# Altium schematic sheet Sheet1.SchDoc
size OrCAD D; SheetNumber: 1; SheetTotal: 1
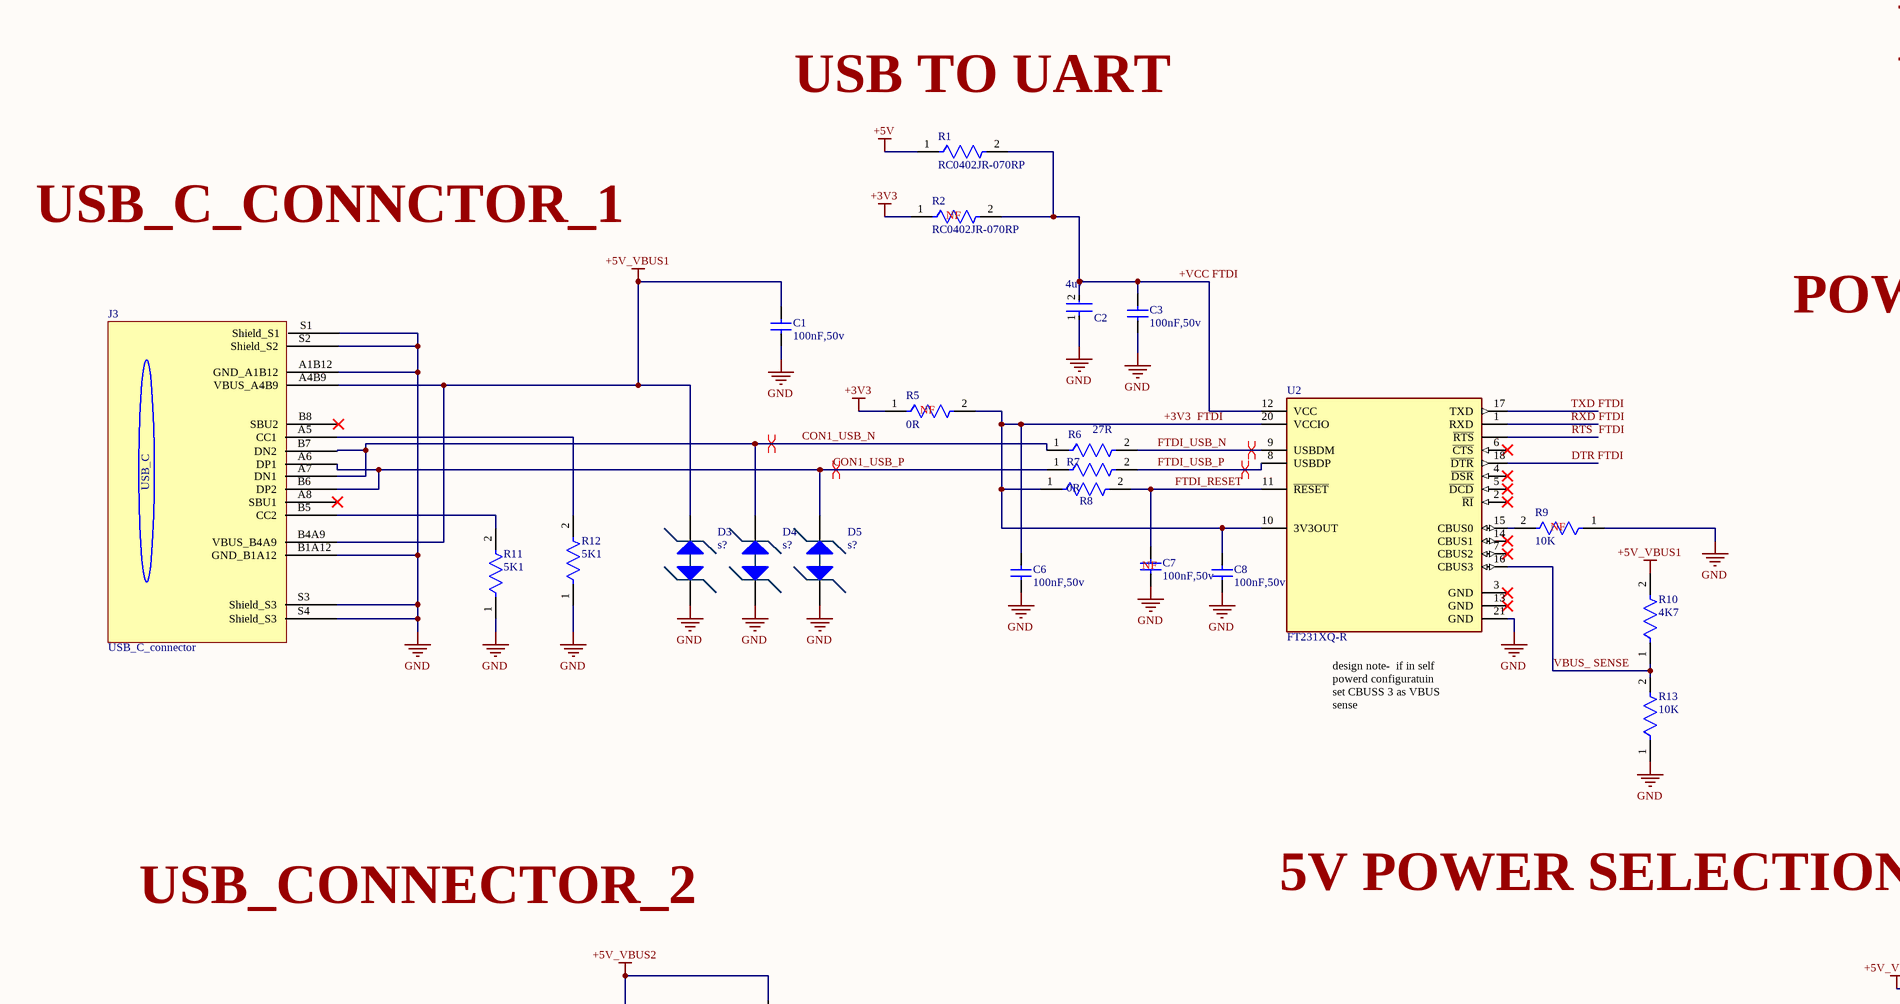
[diagram p0: Sheet1.SchDoc, top left]
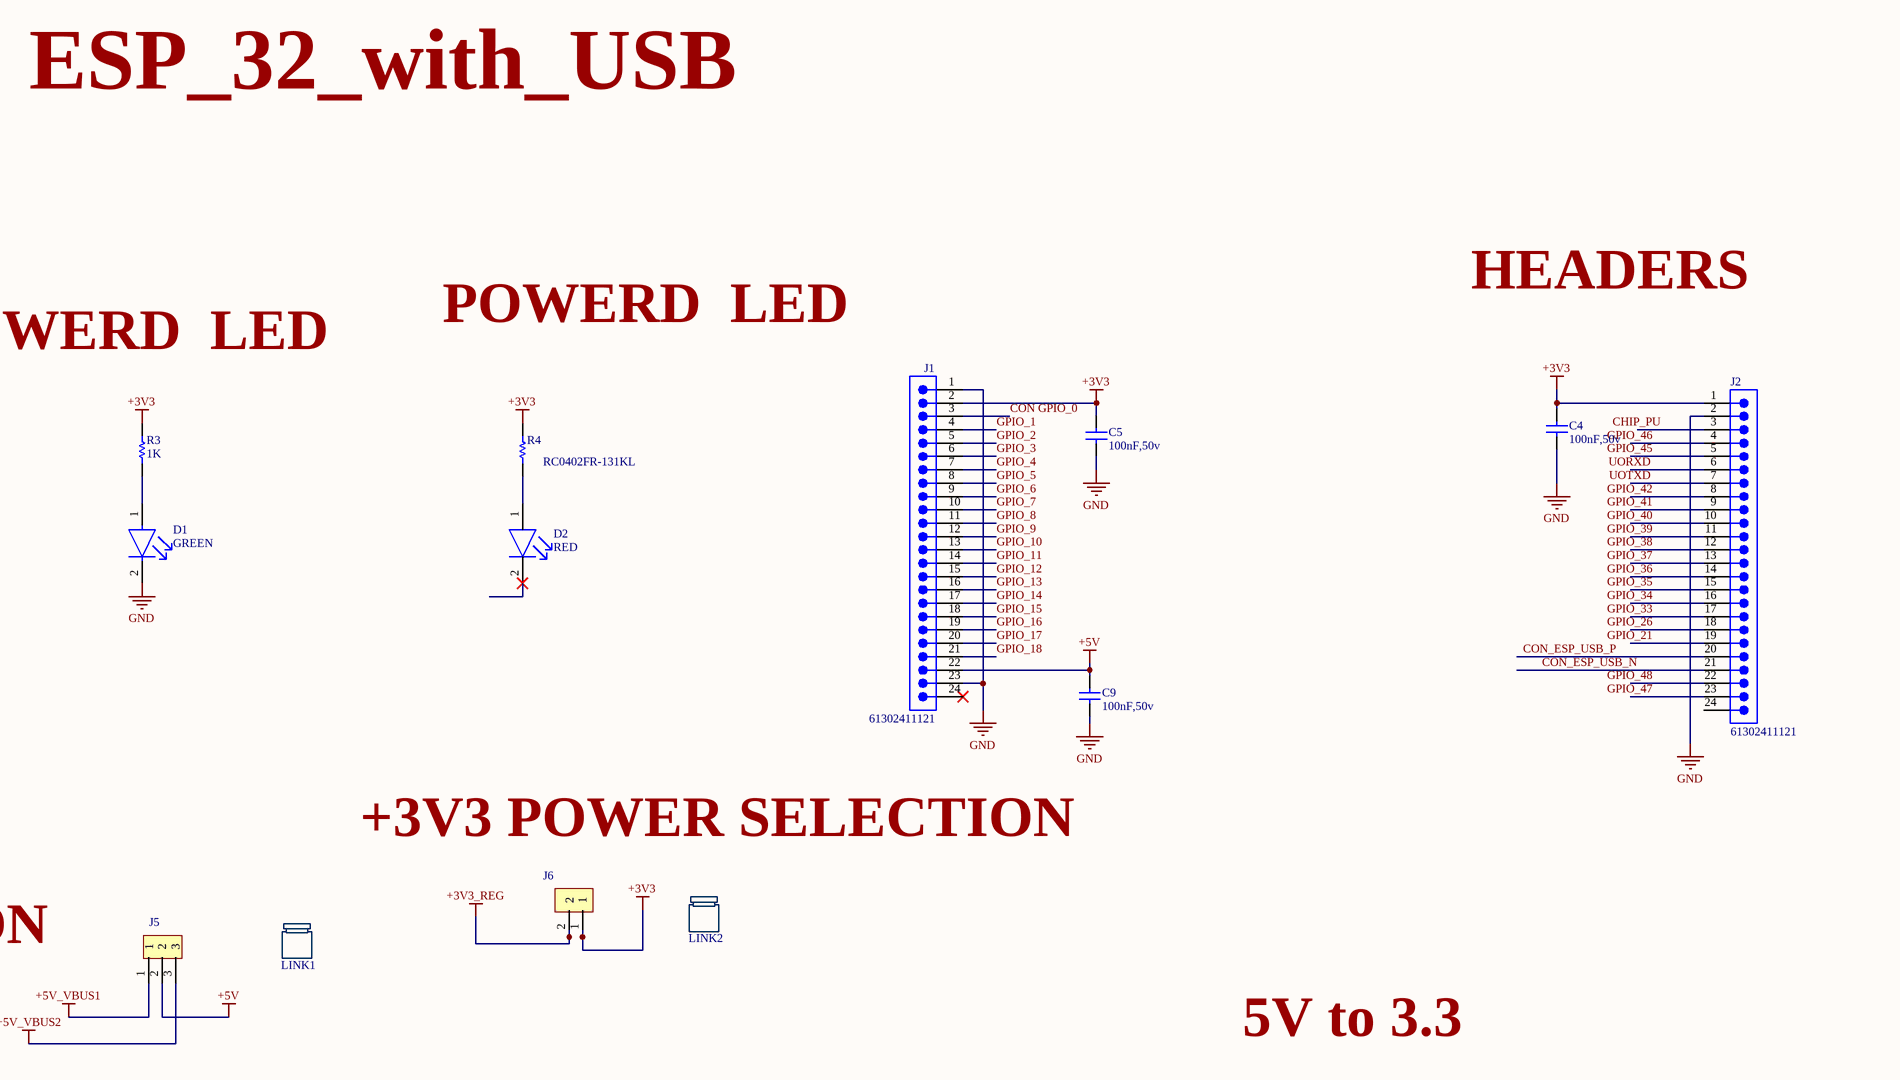
[diagram p1: Sheet1.SchDoc, top right]
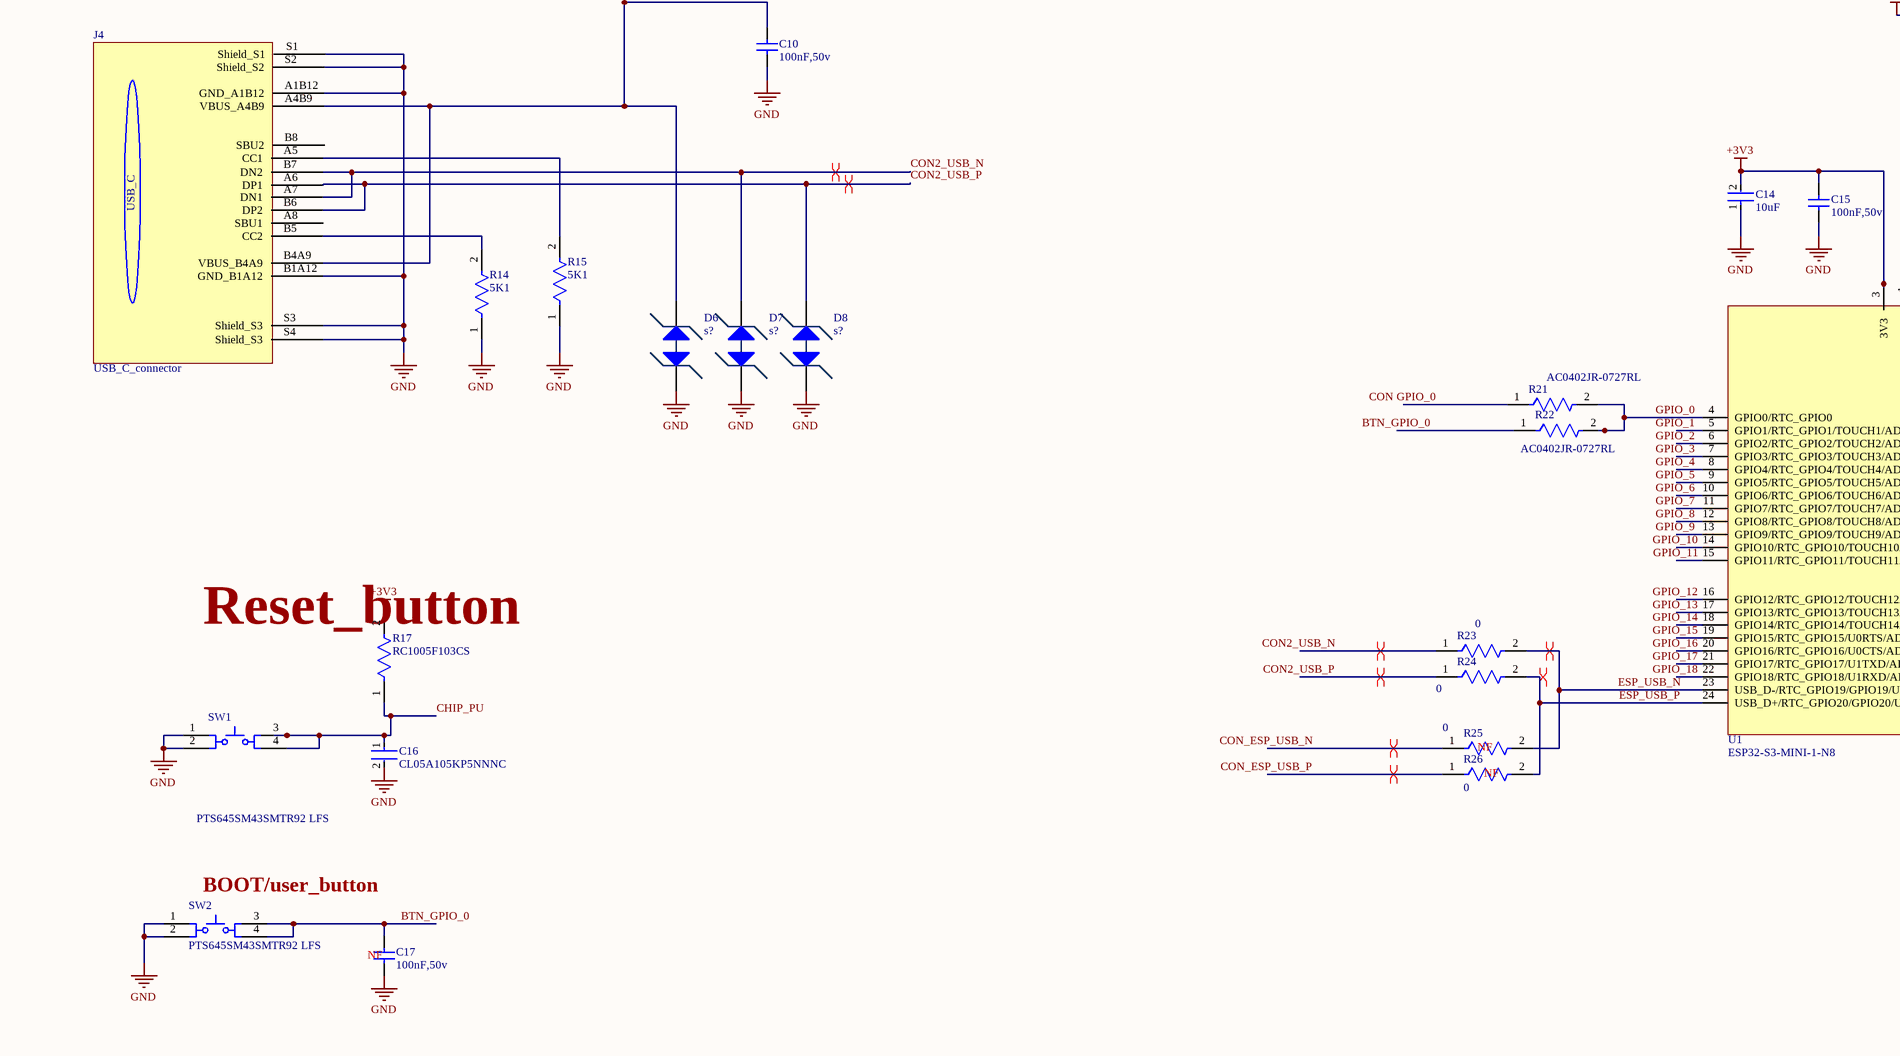
[diagram p2: Sheet1.SchDoc, bottom left]
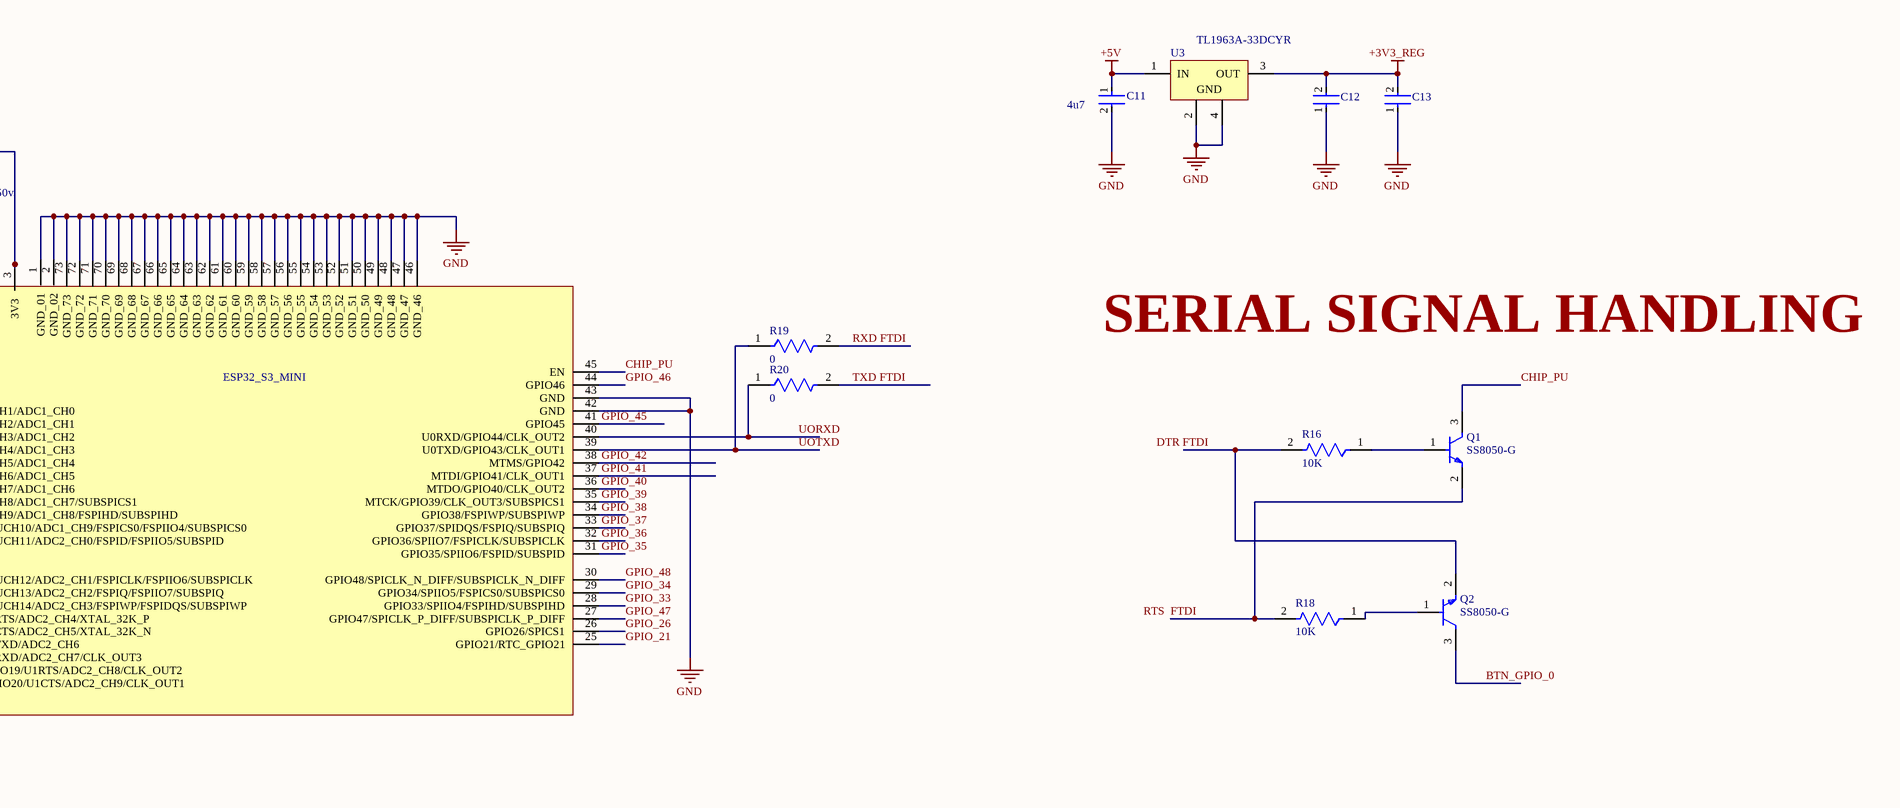
[diagram p3: Sheet1.SchDoc, bottom right]

## Parts
C1  100nF,50v  [CAPC1005X55N]
C2  4u7  [FP-CL829-IPC_C]
C3  100nF,50v  [CAPC1005X55N]
C4  100nF,50v  [CAPC1005X55N]
C5  100nF,50v  [CAPC1005X55N]
C6  100nF,50v  [CAPC1005X55N]
C7  100nF,50v  [CAPC1005X55N]
C8  100nF,50v  [CAPC1005X55N]
C9  100nF,50v  [CAPC1005X55N]
C10  100nF,50v  [CAPC1005X55N]
C11  4u7  [FP-CL829-IPC_C]
C12  CL05A106MP8NUB8  [FP-CL07-IPC_C]  (value not drawn)
C13  CL05A106MP8NUB8  [FP-CL07-IPC_C]  (value not drawn)
C14  10uF  [FP-CL07-IPC_C]
C15  100nF,50v  [CAPC1005X55N]
C16  CL05A105KP5NNNC  [FP-CL511-IPC_C]
C17  100nF,50v  [CAPC1005X55N]
D1  GREEN  [FP-SM0402GC-MFG]
D2  RED  [FP-SM0402RC-MFG]
D3  s?  [SOD882]
D4  s?  [SOD882]
D5  s?  [SOD882]
D6  s?  [SOD882]
D7  s?  [SOD882]
D8  s?  [SOD882]
J1  61302411121  [61302411121]
J2  61302411121  [61302411121]
J3  USB_C_connector  [FP-2171790001-MFG]
J4  USB_C_connector  [FP-2171790001-MFG]
J5  FTS-103-01-F-S  [HDR_1X3_1.27MM]  (value not drawn)
J6  FTS-102-01-F-S  [HDR_1X2_1.27MM]  (value not drawn)
LINK1  M50-1920005  (value not drawn)  (mechanical)
LINK2  M50-1920005  (value not drawn)  (mechanical)
Q1  SS8050-G  [FP-SS8050-G-MFG]
Q2  SS8050-G  [FP-SS8050-G-MFG]
R1  RC0402JR-070RP  [FP-RC0402-0_4-MFG]
R2  RC0402JR-070RP  [FP-RC0402-0_4-MFG]
R3  1K  [RESC1005X40X25LL05T10]
R4  RC0402FR-131KL  [RESC1005X40X25LL05T10]
R5  0R  [FP-RC0402-0_4-MFG]
R6  27R  [FP-AC0402-MFG]
R7  27R  [FP-AC0402-MFG]  (value not drawn)
R8  0R  [FP-RC0402-0_4-MFG]
R9  10K  [FP-CRGCQ0402-IPC_C]
R10  4K7  [FP-CRGP0402-IPC_C]
R11  5K1  [FP-RC1005-MFG]
R12  5K1  [FP-RC1005-MFG]
R13  10K  [FP-CRGCQ0402-IPC_C]
R14  5K1  [FP-RC1005-MFG]
R15  5K1  [FP-RC1005-MFG]
R16  10K  [FP-CRGCQ0402-IPC_C]
R17  RC1005F103CS  [FP-RC1005-IPC_B]
R18  10K  [FP-CRGCQ0402-IPC_C]
R19  0  [FP-RC0402-0_4-MFG]
R20  0  [FP-RC0402-0_4-MFG]
R21  AC0402JR-0727RL  [FP-AC0402-MFG]
R22  AC0402JR-0727RL  [FP-AC0402-MFG]
R23  0  [FP-RC0402-0_4-MFG]
R24  0  [FP-RC0402-0_4-MFG]
R25  0  [FP-RC0402-0_4-MFG]
R26  0  [FP-RC0402-0_4-MFG]
SW1  PTS645SM43SMTR92 LFS  [CKCP-PTS645S_V]
SW2  PTS645SM43SMTR92 LFS  [CKCP-PTS645S_V]
U1  ESP32-S3-MINI-1-N8  [XCVR_ESP32-S3-MINI-1-N8]
U2  FT231XQ-R  [FP-QFN-20-MFG]
U3  TL1963A-33DCYR  [DCY0004A_N]

## Nets
+3V3: C4.2 C5.2 C14.2 C15.2 J1.2 J2.1 J6.1 R2.1 R3.2 R4.2 R5.1 R17.2 U1.3(3V3)
+3V3_REG: C12.2 C13.2 J6.2 U3.3(OUT)
+5V: C9.2 C11.1 J1.22 J5.2 R1.1 U3.1(IN)
+5V_VBUS1: C1.2 D3.2 J3.A4B9(VBUS_A4B9) J3.B4A9(VBUS_B4A9) J5.1 R10.2
+5V_VBUS2: C10.2 D6.2 J4.A4B9(VBUS_A4B9) J4.B4A9(VBUS_B4A9) J5.3
GND: C1.1 C2.1 C3.1 C4.1 C5.1 C6.1 C7.1 C8.1 C9.1 C10.1 C11.2 C12.1 C13.1 C14.1 C15.1 C16.2 C17.1 D1.2(C) D3.1 D4.1 D5.1 D6.1 D7.1 D8.1 J1.1 J1.23 J2.2 J3.A1B12(GND_A1B12) J3.B1A12(GND_B1A12) J3.S1(Shield_S1) J3.S2(Shield_S2) J3.S3(Shield_S3) J3.S4(Shield_S3) J4.A1B12(GND_A1B12) J4.B1A12(GND_B1A12) J4.S1(Shield_S1) J4.S2(Shield_S2) J4.S3(Shield_S3) J4.S4(Shield_S3) R9.1 R11.1 R12.1 R13.1 R14.1 R15.1 SW1.1 SW1.2 SW2.1 SW2.2 U1.1(GND_01) U1.2(GND_02) U1.42(GND) U1.43(GND) U1.46(GND_46) U1.47(GND_47) U1.48(GND_48) U1.49(GND_49) U1.50(GND_50) U1.51(GND_51) U1.52(GND_52) U1.53(GND_53) U1.54(GND_54) U1.55(GND_55) U1.56(GND_56) U1.57(GND_57) U1.58(GND_58) U1.59(GND_59) U1.60(GND_60) U1.61(GND_61) U1.62(GND_62) U1.63(GND_63) U1.64(GND_64) U1.65(GND_65) U1.66(GND_66) U1.67(GND_67) U1.68(GND_68) U1.69(GND_69) U1.70(GND_70) U1.71(GND_71) U1.72(GND_72) U1.73(GND_73) U2.21(GND) U3.2(GND) U3.4(GND)
+3V3  FTDI: C6.2 C8.2 R5.2 R8.1 U2.10(3V3OUT) U2.20(VCCIO)
+VCC FTDI: C2.2 C3.2 R1.2 R2.2 U2.12(VCC)
BTN_GPIO_0: C17.2 Q2.3(C) R22.1 SW2.3 SW2.4
CHIP_PU: C16.1 J2.3 Q1.3(C) R17.1 SW1.3 SW1.4 U1.45(EN)
CON1_USB_N: D4.2 J3.A7(DN1) J3.B7(DN2) R6.1
CON1_USB_P: D5.2 J3.A6(DP1) J3.B6(DP2) R7.1
CON2_USB_N: D7.2 J4.A7(DN1) J4.B7(DN2) R23.1
CON2_USB_P: D8.2 J4.A6(DP1) J4.B6(DP2) R24.1
CON GPIO_0: J1.3 R21.1
CON_ESP_USB_N: J2.21 R25.1
CON_ESP_USB_P: J2.20 R26.1
DTR FTDI: Q2.2(E) R16.2 U2.18(~{DTR})
ESP_USB_N: R23.2 R25.2 U1.23(USB_D-/RTC_GPIO19/GPIO19/U1RTS/ADC2_CH8/CLK_OUT2)
ESP_USB_P: R24.2 R26.2 U1.24(USB_D+/RTC_GPIO20/GPIO20/U1CTS/ADC2_CH9/CLK_OUT1)
FTDI_RESET: C7.2 R8.2 U2.11(~{RESET})
FTDI_USB_N: R6.2 U2.9(USBDM)
FTDI_USB_P: R7.2 U2.8(USBDP)
GPIO_0: R21.2 R22.2 U1.4(GPIO0/RTC_GPIO0)
GPIO_1: J1.4 U1.5(GPIO1/RTC_GPIO1/TOUCH1/ADC1_CH0)
GPIO_2: J1.5 U1.6(GPIO2/RTC_GPIO2/TOUCH2/ADC1_CH1)
GPIO_3: J1.6 U1.7(GPIO3/RTC_GPIO3/TOUCH3/ADC1_CH2)
GPIO_4: J1.7 U1.8(GPIO4/RTC_GPIO4/TOUCH4/ADC1_CH3)
GPIO_5: J1.8 U1.9(GPIO5/RTC_GPIO5/TOUCH5/ADC1_CH4)
GPIO_6: J1.9 U1.10(GPIO6/RTC_GPIO6/TOUCH6/ADC1_CH5)
GPIO_7: J1.10 U1.11(GPIO7/RTC_GPIO7/TOUCH7/ADC1_CH6)
GPIO_8: J1.11 U1.12(GPIO8/RTC_GPIO8/TOUCH8/ADC1_CH7/SUBSPICS1)
GPIO_9: J1.12 U1.13(GPIO9/RTC_GPIO9/TOUCH9/ADC1_CH8/FSPIHD/SUBSPIHD)
GPIO_10: J1.13 U1.14(GPIO10/RTC_GPIO10/TOUCH10/ADC1_CH9/FSPICS0/FSPIIO4/SUBSPICS0)
GPIO_11: J1.14 U1.15(GPIO11/RTC_GPIO11/TOUCH11/ADC2_CH0/FSPID/FSPIIO5/SUBSPID)
GPIO_12: J1.15 U1.16(GPIO12/RTC_GPIO12/TOUCH12/ADC2_CH1/FSPICLK/FSPIIO6/SUBSPICLK)
GPIO_13: J1.16 U1.17(GPIO13/RTC_GPIO13/TOUCH13/ADC2_CH2/FSPIQ/FSPIIO7/SUBSPIQ)
GPIO_14: J1.17 U1.18(GPIO14/RTC_GPIO14/TOUCH14/ADC2_CH3/FSPIWP/FSPIDQS/SUBSPIWP)
GPIO_15: J1.18 U1.19(GPIO15/RTC_GPIO15/U0RTS/ADC2_CH4/XTAL_32K_P)
GPIO_16: J1.19 U1.20(GPIO16/RTC_GPIO16/U0CTS/ADC2_CH5/XTAL_32K_N)
GPIO_17: J1.20 U1.21(GPIO17/RTC_GPIO17/U1TXD/ADC2_CH6)
GPIO_18: J1.21 U1.22(GPIO18/RTC_GPIO18/U1RXD/ADC2_CH7/CLK_OUT3)
GPIO_21: J2.19 U1.25(GPIO21/RTC_GPIO21)
GPIO_26: J2.18 U1.26(GPIO26/SPICS1)
GPIO_33: J2.17 U1.28(GPIO33/SPIIO4/FSPIHD/SUBSPIHD)
GPIO_34: J2.16 U1.29(GPIO34/SPIIO5/FSPICS0/SUBSPICS0)
GPIO_35: J2.15 U1.31(GPIO35/SPIIO6/FSPID/SUBSPID)
GPIO_36: J2.14 U1.32(GPIO36/SPIIO7/FSPICLK/SUBSPICLK)
GPIO_37: J2.13 U1.33(GPIO37/SPIDQS/FSPIQ/SUBSPIQ)
GPIO_38: J2.12 U1.34(GPIO38/FSPIWP/SUBSPIWP)
GPIO_39: J2.11 U1.35(MTCK/GPIO39/CLK_OUT3/SUBSPICS1)
GPIO_40: J2.10 U1.36(MTDO/GPIO40/CLK_OUT2)
GPIO_41: J2.9 U1.37(MTDI/GPIO41/CLK_OUT1)
GPIO_42: J2.8 U1.38(MTMS/GPIO42)
GPIO_45: J2.5 U1.41(GPIO45)
GPIO_46: J2.4 U1.44(GPIO46)
GPIO_47: J2.23 U1.27(GPIO47/SPICLK_P_DIFF/SUBSPICLK_P_DIFF)
GPIO_48: J2.22 U1.30(GPIO48/SPICLK_N_DIFF/SUBSPICLK_N_DIFF)
RTS  FTDI: Q1.2(E) R18.2 U2.19(~{RTS})
RXD FTDI: R19.2 U2.1(RXD)
TXD FTDI: R20.2 U2.17(TXD)
UORXD: J2.6 R20.1 U1.40(U0RXD/GPIO44/CLK_OUT2)
UOTXD: J2.7 R19.1 U1.39(U0TXD/GPIO43/CLK_OUT1)
VBUS_ SENSE: R10.1 R13.2 U2.16(CBUS3)
NetD1_1: D1.1(A) R3.1
NetD2_1: D2.1(A) R4.1
NetJ3_A5: J3.A5(CC1) R12.2
NetJ3_B5: J3.B5(CC2) R11.2
NetJ4_A5: J4.A5(CC1) R15.2
NetJ4_B5: J4.B5(CC2) R14.2
NetQ1_1: Q1.1(B) R16.1
NetQ2_1: Q2.1(B) R18.1
NetR9_2: R9.2 U2.15(CBUS0)

Not connected (* = marked no-connect by the designer): D2 2(C)*; J1 24*; J2 24; J3 A8(SBU1)* B8(SBU2)*; J4 A8(SBU1) B8(SBU2); U2 2(~{RI})* 3(GND)* 4(~{DSR})* 5(~{DCD})* 6(~{CTS})* 7(CBUS2)* 13(GND)* 14(CBUS1)*

## Layout directives
differential pair; differential pair class *: CON2_USB_N
differential pair: CON1_USB_N, CON1_USB_P, CON2_USB_N, CON2_USB_P, CON_ESP_USB_N, CON_ESP_USB_P, ESP_USB_N, ESP_USB_P, FTDI_USB_N, FTDI_USB_P

## Notes on the sheet
- (near R1) USB TO UART
- ESP_32_with_USB
- USB_C_CONNCTOR_1
- (near R2) NF
- HEADERS
- POWERD  LED
- (near R5) NF
- (near C7) NF
- (near R9) NF
- (near U2) design note-  if in self powerd configuratuin set CBUSS 3 as VBUS sense
- +3V3 POWER SELECTION
- USB_CONNECTOR_2
- 5V POWER SELECTION
- 5V to 3.3
- SERIAL SIGNAL HANDLING
- (near R17) Reset_button
- (near R25) NF
- (near R26) NF
- (near SW2) BOOT/user_button
- (near C17) NF
- (in symbol ESP32-S3-MINI-1-N8) ESP32_S3_MINI
- (in symbol USB_C_connector) USB_C

## Library data of the parts
C1 C3-C10 C15 C17 = CL05B104KB54PNC: Manufacturer: Samsung Electro-Mechanics; Dielectric Material: Ceramic; Tolerance: 10%; Supplier: Future Electronics; Supplier Part Number: 8121545; Manufacturer Part Number: CL05B104KB54PNC; RoHS: Compliant; Category: Ceramic Capacitors; Stock: 3520000; Pricing: 10000=0.0042, 30000=0.0041, 50000=0.004, 200000=0.0039, 300000=0.0038 (USD); Value: 100nF; Case/Package: 0402; China RoHS: Compliant; Country of Origin: Mainland China, Philippines, South Korea; Export Control Classification Number (ECCN) Code: EAR99; Height: 500µm; Harmonized Tariff Schedule (HTS) Code: 8532.24.00.20; Introduction Date: 2018-07-31; Length: 1mm; Lifecycle Status: Production; Material: Ceramic; Max Operating Temperature: 125°C; Min Operating Temperature: -55°C; Mounting Technology: Surface Mount; Number of Terminals: 2; REACH SVHC: Yes; Schedule B: 8532240020, 8532240020|8532240020|8532240020|8532240020|8532240020|8532240020|8532240020|8532240020|8532240020|8532240020|8532240020|8532240020|8532240020|8532240020|8532240020|8532240020|8532240020|8532240020|8532240020|8532240020|8532240020|8532240020|8532240020|85; Voltage Rating: 50V; Voltage Rating (DC): 50V; Width: 500µm; ComponentLink1URL: https://datasheet.octopart.com:443/CL05B104KB54PNC-Samsung-Electro-Mechanics-datasheet-182018727.pdf?src-supplier=IHS; ComponentLink1Description: https://datasheet.octopart.com:443/CL05B104KB54PNC-Samsung-Electro-Mechanics-datasheet-182018727.pdf?src-supplier=IHS; ComponentLink2URL: https://datasheet.octopart.com:443/CL05B104KB54PNC-Samsung-Electro-Mechanics-datasheet-138685816.pdf?src-supplier=Samsung+SCT; ComponentLink2Description: https://datasheet.octopart.com:443/CL05B104KB54PNC-Samsung-Electro-Mechanics-datasheet-138685816.pdf?src-supplier=Samsung+SCT; ComponentLink3URL: https://datasheet.octopart.com:443/CL05B104KB54PNC-Samsung-datasheet-8326407.pdf?src-supplier=TME; ComponentLink3Description: https://datasheet.octopart.com:443/CL05B104KB54PNC-Samsung-datasheet-8326407.pdf?src-supplier=TME
C2 C11 = CMP-13271-001468-1: Cap Ceramic 4.7uF 16V X5R ±20% SMD 0402 +85°C Paper T/R; Mount: Surface Mount; Case Code (Metric): 1005; Case/Package: 0402; Length: 0.039inch; Capacitance: 4.7uF; Voltage Rating: 16V; Max Operating Temperature: 85°C; Tolerance: 20%; Thickness: 0.022inch; Min Operating Temperature: -55°C; Case Code (Imperial): 0402; Packaging: Tape and Reel; Width: 0.02inch
C12-C14 = CMP-13271-002778-1: Cap Ceramic 10uF 10V X5R ±20% SMD 0402 +85°C Paper T/R; Length: 0.039inch; Mount: Surface Mount; Case Code (Imperial): 0402; Capacitance: 10uF; Max Operating Temperature: 85°C; Voltage Rating: 10V; Min Operating Temperature: -55°C; Case/Package: 0402; Thickness: 0.035inch; Width: 0.02inch; Case Code (Metric): 1005; Packaging: Tape and Reel; Tolerance: 20%
C16 = CMP-13271-001936-1: Cap Ceramic 1uF 10V X5R ±10% SMD 0402 +85°C Paper T/R; Depth: 0.5mm; Case Code (Imperial): 0402; Material: Ceramic; Mount: Surface Mount; Thickness: 0.022inch; Dielectric: X5R; Capacitance: 1uF; Radiation Hardening: No; Case/Package: 0402; Length: 1mm; Tolerance: 10%; Max Operating Temperature: 85°C; Package Quantity: 1; Width: 0.02inch; Voltage Rating: 10V; Contact Plating: Tin; Height: 0.5mm; Min Operating Temperature: -55°C; Case Code (Metric): 1005; Packaging: Tape and Reel
D1 = CMP-35283-000001-2: LED GREEN CLEAR 0402 SMD; Lens Size: 1mm; Luminous Intensity: 28.5mcd; Viewing Angle: 130°; Forward Voltage: 1.9V; Test Current: 20mA; Lens Color: Colorless; Lens Style: Flat; Dominant Wavelength: 572nm; Case Code (Metric): 1005; Mount: Surface Mount; Case Code (Imperial): 0402; Length: 1mm; Width: 0.5mm; Case/Package: 0402; Lens Transparency: Clear; Height: 0.71mm; Packaging: Tape and Reel; Color: Green
D2 = CMP-35283-000003-1: LED RED CLEAR 0402 SMD; Test Current: 20mA; Luminous Intensity: 90mcd; Lens Color: Colorless; Lens Style: Flat; Lens Size: 1mm; Forward Voltage: 2.1V; Viewing Angle: 130°; Dominant Wavelength: 631nm; Width: 0.5mm; Length: 1mm; Packaging: Tape and Reel; Height: 0.71mm; Lens Transparency: Clear; Case Code (Imperial): 0402; Case/Package: 0402; Mount: Surface Mount; Case Code (Metric): 1005; Color: Red
D3-D8 = AQ3045-01ETG
J1 J2 = CMP-1502-01109-4: THT Vertical Pin Header WR-PHD, Pitch 2.54 mm, Single Row, 24 pins; Number of Contacts: 24; Current Rating: 3A; Gender: Male; Connector Type: Male Pin; Contact Resistance: 20mΩ; Pitch: 2.54mm; Operating Supply Voltage: 250V; Contact Material: Copper; Mount: Through Hole; Number of Pins: 24; Contact Mating Length: 5.9944mm; Number of Rows: 1; Contact Plating: Gold; Orientation: Vertical; Number of Positions: 24; Color: Black; Lead Pitch: 2.54mm; RoHS: Compliant; Termination: Solder; Packaging: Bulk
J5 = FTS-103-01-F-S: Manufacturer: Samtec; Manufacturer Lifecycle Status: PRODUCTION; Gender: Male; Number of Contacts: 3; Pitch: 1.27mm; Supplier: Farnell; Supplier Part Number: 3657477; Manufacturer Part Number: FTS-103-01-F-S; RoHS: Compliant; Category: Headers and Wire Housings; Stock: 11; Pricing: 10=0.79, 50=0.612, 100=0.516, 250=0.473, 500=0.43 (EUR); Contact Plating: Gold; Lifecycle Status: Production; Mounting Technology: Through Hole; Number of Rows: 1; Packaging: Bulk; Radiation Hardening: No; Termination: Solder; ComponentLink1URL: https://datasheet.octopart.com:443/FTS-103-01-F-S-Samtec-datasheet-97029283.pdf?src-supplier=Newark; ComponentLink1Description: https://datasheet.octopart.com:443/FTS-103-01-F-S-Samtec-datasheet-97029283.pdf?src-supplier=Newark; ComponentLink2URL: https://datasheet.octopart.com:443/FTS-103-01-F-S-Samtec-datasheet-165596534.pdf?src-supplier=Newark; ComponentLink2Description: https://datasheet.octopart.com:443/FTS-103-01-F-S-Samtec-datasheet-165596534.pdf?src-supplier=Newark; ComponentLink3URL: https://sigma.octopart.com:443/97029285/technical_drawing/Samtec-FTS-103-01-F-S.pdf?src-supplier=element14+APAC; ComponentLink3Description: https://sigma.octopart.com:443/97029285/technical_drawing/Samtec-FTS-103-01-F-S.pdf?src-supplier=element14+APAC; ComponentLink4URL: https://datasheet.octopart.com:443/FTS-103-01-F-S-Samtec-datasheet-118493358.pdf?src-supplier=Electro+Sonic; ComponentLink4Description: https://datasheet.octopart.com:443/FTS-103-01-F-S-Samtec-datasheet-118493358.pdf?src-supplier=Electro+Sonic; ComponentLink5URL: https://datasheet.octopart.com:443/FTS-103-01-F-S-Samtec-datasheet-176663378.pdf?src-supplier=Toby+Electronics; ComponentLink5Description: https://datasheet.octopart.com:443/FTS-103-01-F-S-Samtec-datasheet-176663378.pdf?src-supplier=Toby+Electronics; ComponentLink6URL: https://datasheet.octopart.com:443/FTS-103-01-F-S-Samtec-datasheet-116535195.pdf?src-supplier=Toby+Electronics; ComponentLink6Description: https://datasheet.octopart.com:443/FTS-103-01-F-S-Samtec-datasheet-116535195.pdf?src-supplier=Toby+Electronics; ComponentLink7URL: https://datasheet.octopart.com:443/FTS-103-01-F-S-Samtec-datasheet-136395376.pdf?src-supplier=Toby+Electronics; ComponentLink7Description: https://datasheet.octopart.com:443/FTS-103-01-F-S-Samtec-datasheet-136395376.pdf?src-supplier=Toby+Electronics; ComponentLink8URL: https://datasheet.octopart.com:443/FTS-103-01-F-S-Samtec-datasheet-151470456.pdf?src-supplier=Sager+Electronics; ComponentLink8Description: https://datasheet.octopart.com:443/FTS-103-01-F-S-Samtec-datasheet-151470456.pdf?src-supplier=Sager+Electronics
J6 = FTS-102-01-F-S: Manufacturer: Samtec; Manufacturer Lifecycle Status: PRODUCTION; Gender: Male; Number of Contacts: 2; Pitch: 1.27mm; Supplier: Mouser; Supplier Part Number: 200-FTS10201FS; Manufacturer Part Number: FTS-102-01-F-S; RoHS: Compliant; Category: Headers and Wire Housings; Stock: 1186; Pricing: 1=0.49, 10=0.49, 50=0.425, 100=0.36, 1000=0.268, 10000=0.133 (USD); Contact Plating: Gold; Lifecycle Status: Production; Mounting Technology: Through Hole; Number of Rows: 1; Packaging: Bulk; Radiation Hardening: No; Termination: Solder; ComponentLink1URL: https://datasheet.octopart.com:443/FTS-102-01-F-S-Samtec-datasheet-97029283.pdf?src-supplier=Newark; ComponentLink1Description: https://datasheet.octopart.com:443/FTS-102-01-F-S-Samtec-datasheet-97029283.pdf?src-supplier=Newark; ComponentLink2URL: https://sigma.octopart.com:443/97029285/technical_drawing/Samtec-FTS-102-01-F-S.pdf?src-supplier=Newark; ComponentLink2Description: https://sigma.octopart.com:443/97029285/technical_drawing/Samtec-FTS-102-01-F-S.pdf?src-supplier=Newark; ComponentLink3URL: https://datasheet.octopart.com:443/FTS-102-01-F-S-Samtec-datasheet-118493358.pdf?src-supplier=Electro+Sonic; ComponentLink3Description: https://datasheet.octopart.com:443/FTS-102-01-F-S-Samtec-datasheet-118493358.pdf?src-supplier=Electro+Sonic; ComponentLink4URL: https://datasheet.octopart.com:443/FTS-102-01-F-S-Samtec-datasheet-165596534.pdf?src-supplier=JRH+Electronics; ComponentLink4Description: https://datasheet.octopart.com:443/FTS-102-01-F-S-Samtec-datasheet-165596534.pdf?src-supplier=JRH+Electronics; ComponentLink5URL: https://datasheet.octopart.com:443/FTS-102-01-F-S-Samtec-datasheet-176663378.pdf?src-supplier=Toby+Electronics; ComponentLink5Description: https://datasheet.octopart.com:443/FTS-102-01-F-S-Samtec-datasheet-176663378.pdf?src-supplier=Toby+Electronics; ComponentLink6URL: https://datasheet.octopart.com:443/FTS-102-01-F-S-Samtec-datasheet-116535195.pdf?src-supplier=Toby+Electronics; ComponentLink6Description: https://datasheet.octopart.com:443/FTS-102-01-F-S-Samtec-datasheet-116535195.pdf?src-supplier=Toby+Electronics; ComponentLink7URL: https://datasheet.octopart.com:443/FTS-102-01-F-S-Samtec-datasheet-136395376.pdf?src-supplier=Toby+Electronics; ComponentLink7Description: https://datasheet.octopart.com:443/FTS-102-01-F-S-Samtec-datasheet-136395376.pdf?src-supplier=Toby+Electronics; ComponentLink8URL: https://datasheet.octopart.com:443/FTS-102-01-F-S-Samtec-datasheet-151470456.pdf?src-supplier=Sager+Electronics; ComponentLink8Description: https://datasheet.octopart.com:443/FTS-102-01-F-S-Samtec-datasheet-151470456.pdf?src-supplier=Sager+Electronics
Q1 Q2 = CMP-20235-000001-1: NPN TRANSISTOR 1.5A 40V SOT-23 R; Transition Frequency: 100MHz; Max Breakdown Voltage: 25V; Collector Emitter Voltage (VCEO): 400mV; Max Power Dissipation: 300mW; Max Collector Current: 1.5A; Case/Package: TO-236-3; Packaging: Tape and Reel; RoHS Compliant: Yes; Mount: Surface Mount; Collector Emitter Breakdown Voltage: 25V
R1 R2 R5 R8 R19 R20 R23-R26 = CMP-03412-037830-1: RES SMD 0 OHM JUMPER 1/16W 0402; Max Power Dissipation: 63mW; Resistance: 0mR; Width: 0.02inch; Height: 0.016inch; Length: 0.039inch; Number of Terminations: 2; Max Operating Temperature: 155°C; Case Code (Metric): 1005; Resistor Type: Thick Film; RoHS Compliant: Yes; Packaging: Tape and Reel; Min Operating Temperature: -55°C; Case/Package: 0402; Features: Moisture Resistant; Case Code (Imperial): 0402
R3 = CMP-2002-07865-1: Manufacturer: Yageo; Part Number: RC0402FR-131KL
R4 = CMP-2002-07865-1: Manufacturer: Yageo; Part Number: RC0402FR-131KL
R6 R7 = CMP-03412-042158-1: RES 27Ω ±5% 0.063W 0402; Temperature Coefficient: 100ppm/°C; Max Power Dissipation: 63mW; Resistance: 27R; Packaging: Tape and Reel; Resistor Type: Thick Film; Features: Moisture Resistant; Tolerance: 5%; Number of Terminations: 2; Width: 0.02inch; Min Operating Temperature: -55°C; Series: AC; Case/Package: 0402; RoHS Compliant: Yes; Height: 0.015inch; Length: 0.039inch; Max Operating Temperature: 155°C
R9 R13 R16 R18 = CMP-03211-008081-1: CRGCQ 0402 10K 5%; Manufacturer: TE Connectivity; Manufacturer Part Number: CRGCQ0402J10K; Power Rating: 0.0625W; Tolerance: 0.05; Voltage Rating: 50V; Temperature Coefficient: ±100ppm/°C; Resistance: 10KΩ; Value: 10KΩ; RoHS: TRUE; Octopart: https://octopart.com/crgcq0402j10k-te+connectivity-91017993; ComponentLink2URL: https://www.te.com/commerce/DocumentDelivery/DDEController?Action=showdoc&DocId=Data+Sheet%7F1773204-3%7F1%7Fpdf%7FEnglish%7FENG_DS_1773204-3_1.pdf%7F4-2176347-923; Package: CRGCQ0402; Mouser Description: Res Thick Film 0402 10K Ohm 5% 0.063W(1/16W) ±100ppm/C Pad SMD Automotive T/R; Temperature Range High: +155°C; Composition: Thick Film; Automotive: Yes; Category: Res; Temperature Range Low: -55°C; Height: 0.4mm; Device Class L3: Chip SMD Resistors; Device Class L2: Resistors; Digikey Description: CRGCQ 0402 10K 5%; Ambient Temperature Range High: +70°C; Device Class L1: Passive Components; Lead Free: Yes; ComponentLink2Description: Datasheet; Temperature: -55°C to +155°C; Series: CRGCQ; Ipc Land Pattern Name: RESC10050X35
R10 = CMP-03211-000629-1: CRGP0402 4.7KΩ 0.125W ±100ppm/°C 1% 50V; Manufacturer: TE; Manufacturer Part Number: CRGP0402F4K7; Tolerance: 0.01; Series: CRGP; Temperature Range High: +155°C; RoHS: TRUE; Device Class L2: Resistors; Power Rating: 0.125W; Octopart: https://octopart.com/crgp0402f4k7-te+connectivity-91018703; Temperature: -55°C to +155°C; Height: 0.4mm; ComponentLink2URL: https://www.mouser.ca/datasheet/2/418/NG_DS_9-1773463-9_A-1358566.pdf; Ipc Land Pattern Name: RESC11050X35; Device Class L3: Chip SMD Resistors; Device Class L1: Passive Components; ComponentLink2Description: Datasheet; Voltage Rating: 50V; Temperature Range Low: -55°C; Temperature Coefficient: ±100ppm/°C; Category: Res; Automotive: No; Composition: Thick Film; Package: CRGP0402; Lead Free: Yes; Resistance: 4.7KΩ; Value: 4.7KΩ
R11 R12 R14 R15 = CMP-13261-001006-1: Res Thick Film 0402 5.1kΩ 5% 0.063W ±100ppm/°C Molded SMD T/R; Power Rating: 63mW; Resistance: 5.1kR; Voltage Rating (DC): 50V; Width: 0.02inch; Length: 0.039inch; Case/Package: 0402; Composition: Thick Film; Tolerance: 5%; Min Operating Temperature: -55°C; Number of Terminations: 2; Max Operating Temperature: 155°C; Case Code (Imperial): 0402; Case Code (Metric): 1005; Features: Moisture Resistant; Contact Plating: Tin; Temperature Coefficient: 100ppm/°C; Max Power Dissipation: 63mW; Height: 0.016inch; Package Quantity: 10000; Packaging: Tape and Reel; Lead Free: Lead Free; Radiation Hardening: No
R17 = CMP-13261-004522-1: Res Thick Film 0402 10kΩ 1% 0.063W ±100ppm/°C Molded SMD T/R; Max Power Dissipation: 63mW; Resistance: 10kR; Power Rating: 62.5mW; Package Quantity: 1; Depth: 0.5mm; Radiation Hardening: No; Features: Moisture Resistant; Max Operating Temperature: 155°C; Case Code (Metric): 1005; Military Standard: Not; Case/Package: 0402; Width: 0.02inch; Contact Plating: Tin; Mount: Surface Mount; Packaging: Tape and Reel; Height: 0.016inch; Case Code (Imperial): 0402; Number of Terminations: 2; Composition: Thick Film; Temperature Coefficient: 100ppm/°C; Min Operating Temperature: -55°C; Tolerance: 1%; Length: 1mm
R21 R22 = CMP-03412-042158-1: RES 27Ω ±5% 0.063W 0402; Resistance: 27R; Temperature Coefficient: 100ppm/°C; Max Power Dissipation: 63mW; Packaging: Tape and Reel; Resistor Type: Thick Film; Features: Moisture Resistant; Tolerance: 5%; Number of Terminations: 2; Width: 0.02inch; Min Operating Temperature: -55°C; Series: AC; Case/Package: 0402; RoHS Compliant: Yes; Height: 0.015inch; Length: 0.039inch; Max Operating Temperature: 155°C
SW1 SW2 = CMP-2000-07594-1: Tact Switch, SPST-NO, 50 mA, -20 to 60 degC, 4-Pin SMD, RoHS, Tape and Reel; Manufacturer: C&K Components; Actuator Length: 0.85mm; Voltage Rating (DC): 12V; Mechanical Life: 100000Cycles; Illumination Type: Illuminated; Throw Configuration: SPST; Switch Function: Off-Mom; Actuator Material: Polyamide; Contact Resistance: 100mOhm; Max Current Rating: 50mA; Operating Force: 160gf; Case\/Package: SMD/SMT; Orientation: Straight; RoHSCompliant: True; Manufacturer URL: http://www.ckswitches.com/; Package Quantity: 1000; Datasheet URL: http://www.ckswitches.com/media/1471/pts645.pdf; Colour: Black; Min Operating Temperature: -20degC; Length: 6mm; Mount: SurfaceMount; Depth: 9mm; Max Voltage Rating (DC): 12V; Package Reference: PTS645S; REACH SVHC: NoSVHC; Contact Material: Silver; Packaging: TapeandReel; Package Description: 4-Pin Surface Mount Device, Body 6 x 6 mm, Pitch 4.5 mm; Max Operating Temperature: 60degC; Lead Free: LeadFree; Termination: GullWing; Current Rating: 50mA; Datasheet Version: 04/2016; Mounting Technology: SurfaceMount; Contact Plating: Silver
U1 = ESP32-S3-MINI-1-N8: 20.5dBm ESP32-S3FN8 Chip 2.4GHz SMD WiFi Modules ROHS; Manufacturer: Espressif Systems; Supplier: DigiKey; Supplier Part Number: 5407-ESP32-S3-MINI-1-N8CT-ND; Manufacturer Part Number: ESP32-S3-MINI-1-N8; RoHS: Compliant; Category: RF Transceiver Modules and Modems; Stock: 3118; Pricing: 1=5.28, 10=4.566, 25=4.3196, 100=3.9802, 250=3.7768 (USD); ComponentLink1URL: https://datasheet.octopart.com:443/ESP32-S3-MINI-1-N8-Espressif-Systems-datasheet-188867343.pdf?src-supplier=TME; ComponentLink1Description: https://datasheet.octopart.com:443/ESP32-S3-MINI-1-N8-Espressif-Systems-datasheet-188867343.pdf?src-supplier=TME; ComponentLink2URL: https://datasheet.octopart.com:443/ESP32-S3-MINI-1-N8-Espressif-Systems-datasheet-165560562.pdf?src-supplier=TME; ComponentLink2Description: https://datasheet.octopart.com:443/ESP32-S3-MINI-1-N8-Espressif-Systems-datasheet-165560562.pdf?src-supplier=TME; ComponentLink3URL: https://datasheet.octopart.com:443/ESP32-S3-MINI-1-N8-Espressif-Systems-datasheet-165560559.pdf?src-supplier=TME; ComponentLink3Description: https://datasheet.octopart.com:443/ESP32-S3-MINI-1-N8-Espressif-Systems-datasheet-165560559.pdf?src-supplier=TME; ComponentLink4URL: https://datasheet.octopart.com:443/ESP32-S3-MINI-1-N8-Espressif-Systems-datasheet-192318068.pdf?src-supplier=HQonline; ComponentLink4Description: https://datasheet.octopart.com:443/ESP32-S3-MINI-1-N8-Espressif-Systems-datasheet-192318068.pdf?src-supplier=HQonline; LCSC pad number: C2913206
U2 = CMP-0248-00001-3: IC USB SERIAL FULL UART 20QFN; Data Rate: 12Mbps; Operating Supply Current: 8mA; Min Supply Voltage: 2.97V; Max Supply Voltage: 5.5V; Number of Channels: 1; Min Operating Temperature: -40°C; Case/Package: QFN; Mount: Surface Mount; Number of Pins: 20; Interface: UART; Lead Free: Lead Free; Package Quantity: 5000; Weight: 0.004339oz; Packaging: Tape and Reel; Max Operating Temperature: 85°C
U3 = CMP-0395-00535-2: Single Output Low Noise LDO, 1.5 A, Fixed 3.3 V Output, 2.1 to 20 V Input, 4-pin SOT-223 (DCY), -40 to 125 degC, Green (RoHS & no Sb/Br); Manufacturer: Texas Instruments; Vout Adj(Min)(V): 3.3; Vin(Max)(V): 20; SubFamily: Single Channel LDO; Iq(Typ)(mA): 1; Iout(Max)(A): 1.5; Vin(Min)(V): 2.1; Vdo(Typ)(mV): 340; Accuracy(%): 3; ComponentLink2Description: Datasheet; PackageVersion: 4202506/B; PackageReference: DCY0004A; ComponentLink1Description: Manufacturer URL; Eco-Plan: Green (RoHS & no Sb/Br); ComponentLink1URL: http://www.ti.com/; Fixed Output Options(V): 3.3; ComponentLink2URL: http://www.ti.com/general/docs/lit/getliterature.tsp?genericPartNumber=TL1963A-33&fileType=pdf; Vout Adj(Max)(V): 3.3; PackageDescription: 4-Pin Plastic Small Outline, Body 3.5 x 6.5 mm, Pitch 2.3 mm; ComponentLink3URL: http://www.ti.com/litv/pdf/mpds094a; DatasheetVersion: SLVS719F; PartNumber: TL1963A-33DCYR; Code_JEDEC: TO-261; Mounting Technology: Surface Mount; ComponentLink3Description: Package Specification
J3 J4 = USB_C_connector: LCSC part number: C3197684
LINK1 LINK2 = M50-1920005: LCSC part number: C6986546